# Altium schematic sheet RADM-Master-S00-V00.SchDoc: RADM Master (Machine 2 Machine Radio, Top Level)
size A3; DrawnBy: Jonn Dillon; DocumentNumber: 1; Revision: 00; SheetNumber: 1; SheetTotal: 6; Version: 00; Project: QUTMS RADIO M2M; PageSetup: Record=PageOptions|CenterHorizontal=True|CenterVertical=True|PrintScale=0.97|XCorrection=1.00|YCorrection=1.00|PrintKind=0|BorderSize=5000000|LeftOffset=0|BottomOffset=0|Orientation=2|PaperLength=1000|PaperWidth=1000|Scale=100|PaperSource=7|PrintQuality=-4|MediaType=1|DitherType=10|PaperKind=A4|PrintScaleMode=1
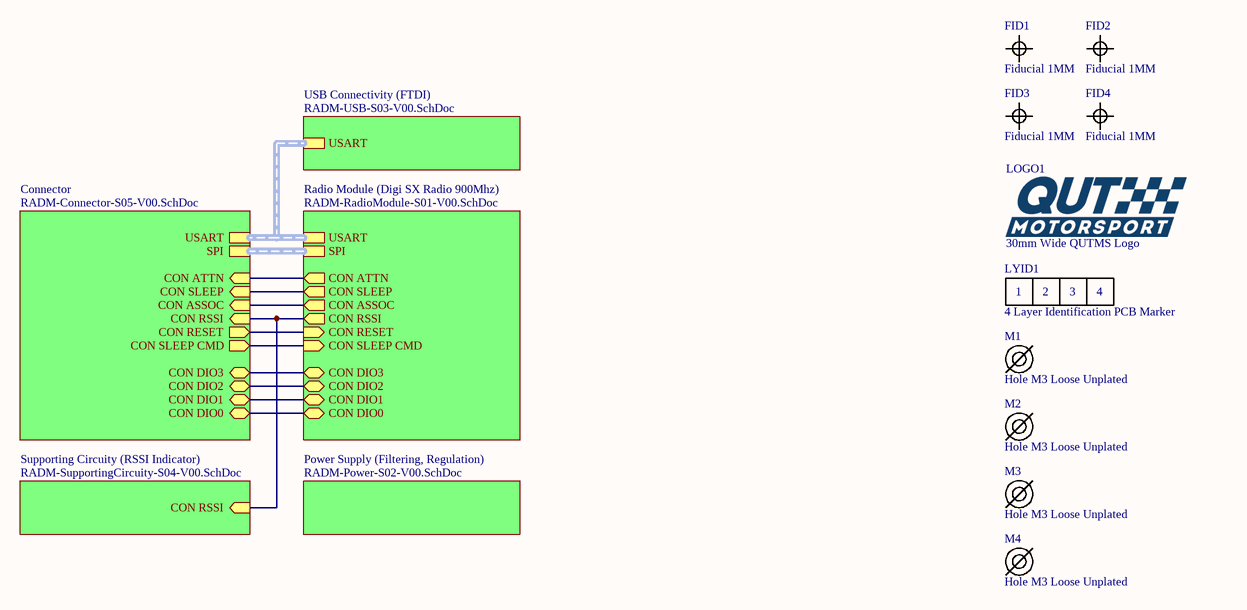
[diagram p0: RADM-Master-S00-V00.SchDoc]

## Parts
FID1  Fiducial 1MM  [FIDUCIAL 1MM]  (no BOM)
FID2  Fiducial 1MM  [FIDUCIAL 1MM]  (no BOM)
FID3  Fiducial 1MM  [FIDUCIAL 1MM]  (no BOM)
FID4  Fiducial 1MM  [FIDUCIAL 1MM]  (no BOM)
LOGO1  30mm Wide QUTMS Logo  [QUTMS LOGO 30MM]  (no BOM)
LYID1  4 Layer Identification PCB Marker  [LAYER IDENT 4]  (no BOM)
M1  Hole M3 Loose Unplated  [M3.5 UNPLATED]  (no BOM)
M2  Hole M3 Loose Unplated  [M3.5 UNPLATED]  (no BOM)
M3  Hole M3 Loose Unplated  [M3.5 UNPLATED]  (no BOM)
M4  Hole M3 Loose Unplated  [M3.5 UNPLATED]  (no BOM)

## Sub-sheets
Connector = RADM-Connector-S05-V00.SchDoc: USART, SPI, CON ATTN (in), CON SLEEP (in), CON ASSOC (in), CON RSSI (in), CON RESET (out), CON SLEEP CMD (out), CON DIO3 (bidir), CON DIO2 (bidir), CON DIO1 (bidir), CON DIO0 (bidir)
Power Supply (Filtering, Regulation) = RADM-Power-S02-V00.SchDoc: no entries
Radio Module (Digi SX Radio 900Mhz) = RADM-RadioModule-S01-V00.SchDoc: CON ATTN (out), USART (harness USART), SPI (harness SPI), CON RESET (in), CON SLEEP (out), CON ASSOC (out), CON RSSI (out), CON SLEEP CMD (in), CON DIO2 (bidir), CON DIO3 (bidir), CON DIO0 (bidir), CON DIO1 (bidir)
Supporting Circuity (RSSI Indicator) = RADM-SupportingCircuity-S04-V00.SchDoc: CON RSSI (in)
USB Connectivity (FTDI) = RADM-USB-S03-V00.SchDoc: USART

## Nets
(unnamed): sheet Radio Module (Digi SX Radio 900Mhz)/CON ATTN, sheet Connector/CON ATTN
(unnamed): sheet Radio Module (Digi SX Radio 900Mhz)/CON RESET, sheet Connector/CON RESET
(unnamed): sheet Radio Module (Digi SX Radio 900Mhz)/CON SLEEP, sheet Connector/CON SLEEP
(unnamed): sheet Radio Module (Digi SX Radio 900Mhz)/CON ASSOC, sheet Connector/CON ASSOC
(unnamed): sheet Radio Module (Digi SX Radio 900Mhz)/CON RSSI, sheet Supporting Circuity (RSSI Indicator)/CON RSSI, sheet Connector/CON RSSI
(unnamed): sheet Radio Module (Digi SX Radio 900Mhz)/CON SLEEP CMD, sheet Connector/CON SLEEP CMD
(unnamed): sheet Radio Module (Digi SX Radio 900Mhz)/CON DIO2, sheet Connector/CON DIO2
(unnamed): sheet Radio Module (Digi SX Radio 900Mhz)/CON DIO3, sheet Connector/CON DIO3
(unnamed): sheet Radio Module (Digi SX Radio 900Mhz)/CON DIO0, sheet Connector/CON DIO0
(unnamed): sheet Radio Module (Digi SX Radio 900Mhz)/CON DIO1, sheet Connector/CON DIO1

## Buses and harness runs
harness sheet Connector/SPI = sheet Radio Module (Digi SX Radio 900Mhz)/SPI
harness sheet Connector/USART = sheet Radio Module (Digi SX Radio 900Mhz)/USART = sheet USB Connectivity (FTDI)/USART

## Notes on the sheet
- Revision History:
- Sheet Title:
- Rev
- Date
- Description
- Project:
- Size:
- Drawn By:
- A3
- Number:
- Revision:
- Sheet
- Version:
- of
- QUT Motorsport
- O-120, Gardens Point
- 2 George Street
- Brisbane, QLD 4000
- Australia
- Print Date:
- Print Time:
- File Name:
- (in symbol Layer Identification 4) 1; 2; 3; 4

## Library data of the parts
LOGO1 = QUTMS Logo 30mm
LYID1 = Layer Identification 4
M1-M4 = Hole M3 Loose Unplated: M3.5 Hole, No Plating